# Altium schematic sheet FlightController.SchDoc
size A2; SheetNumber: 1; SheetTotal: 1
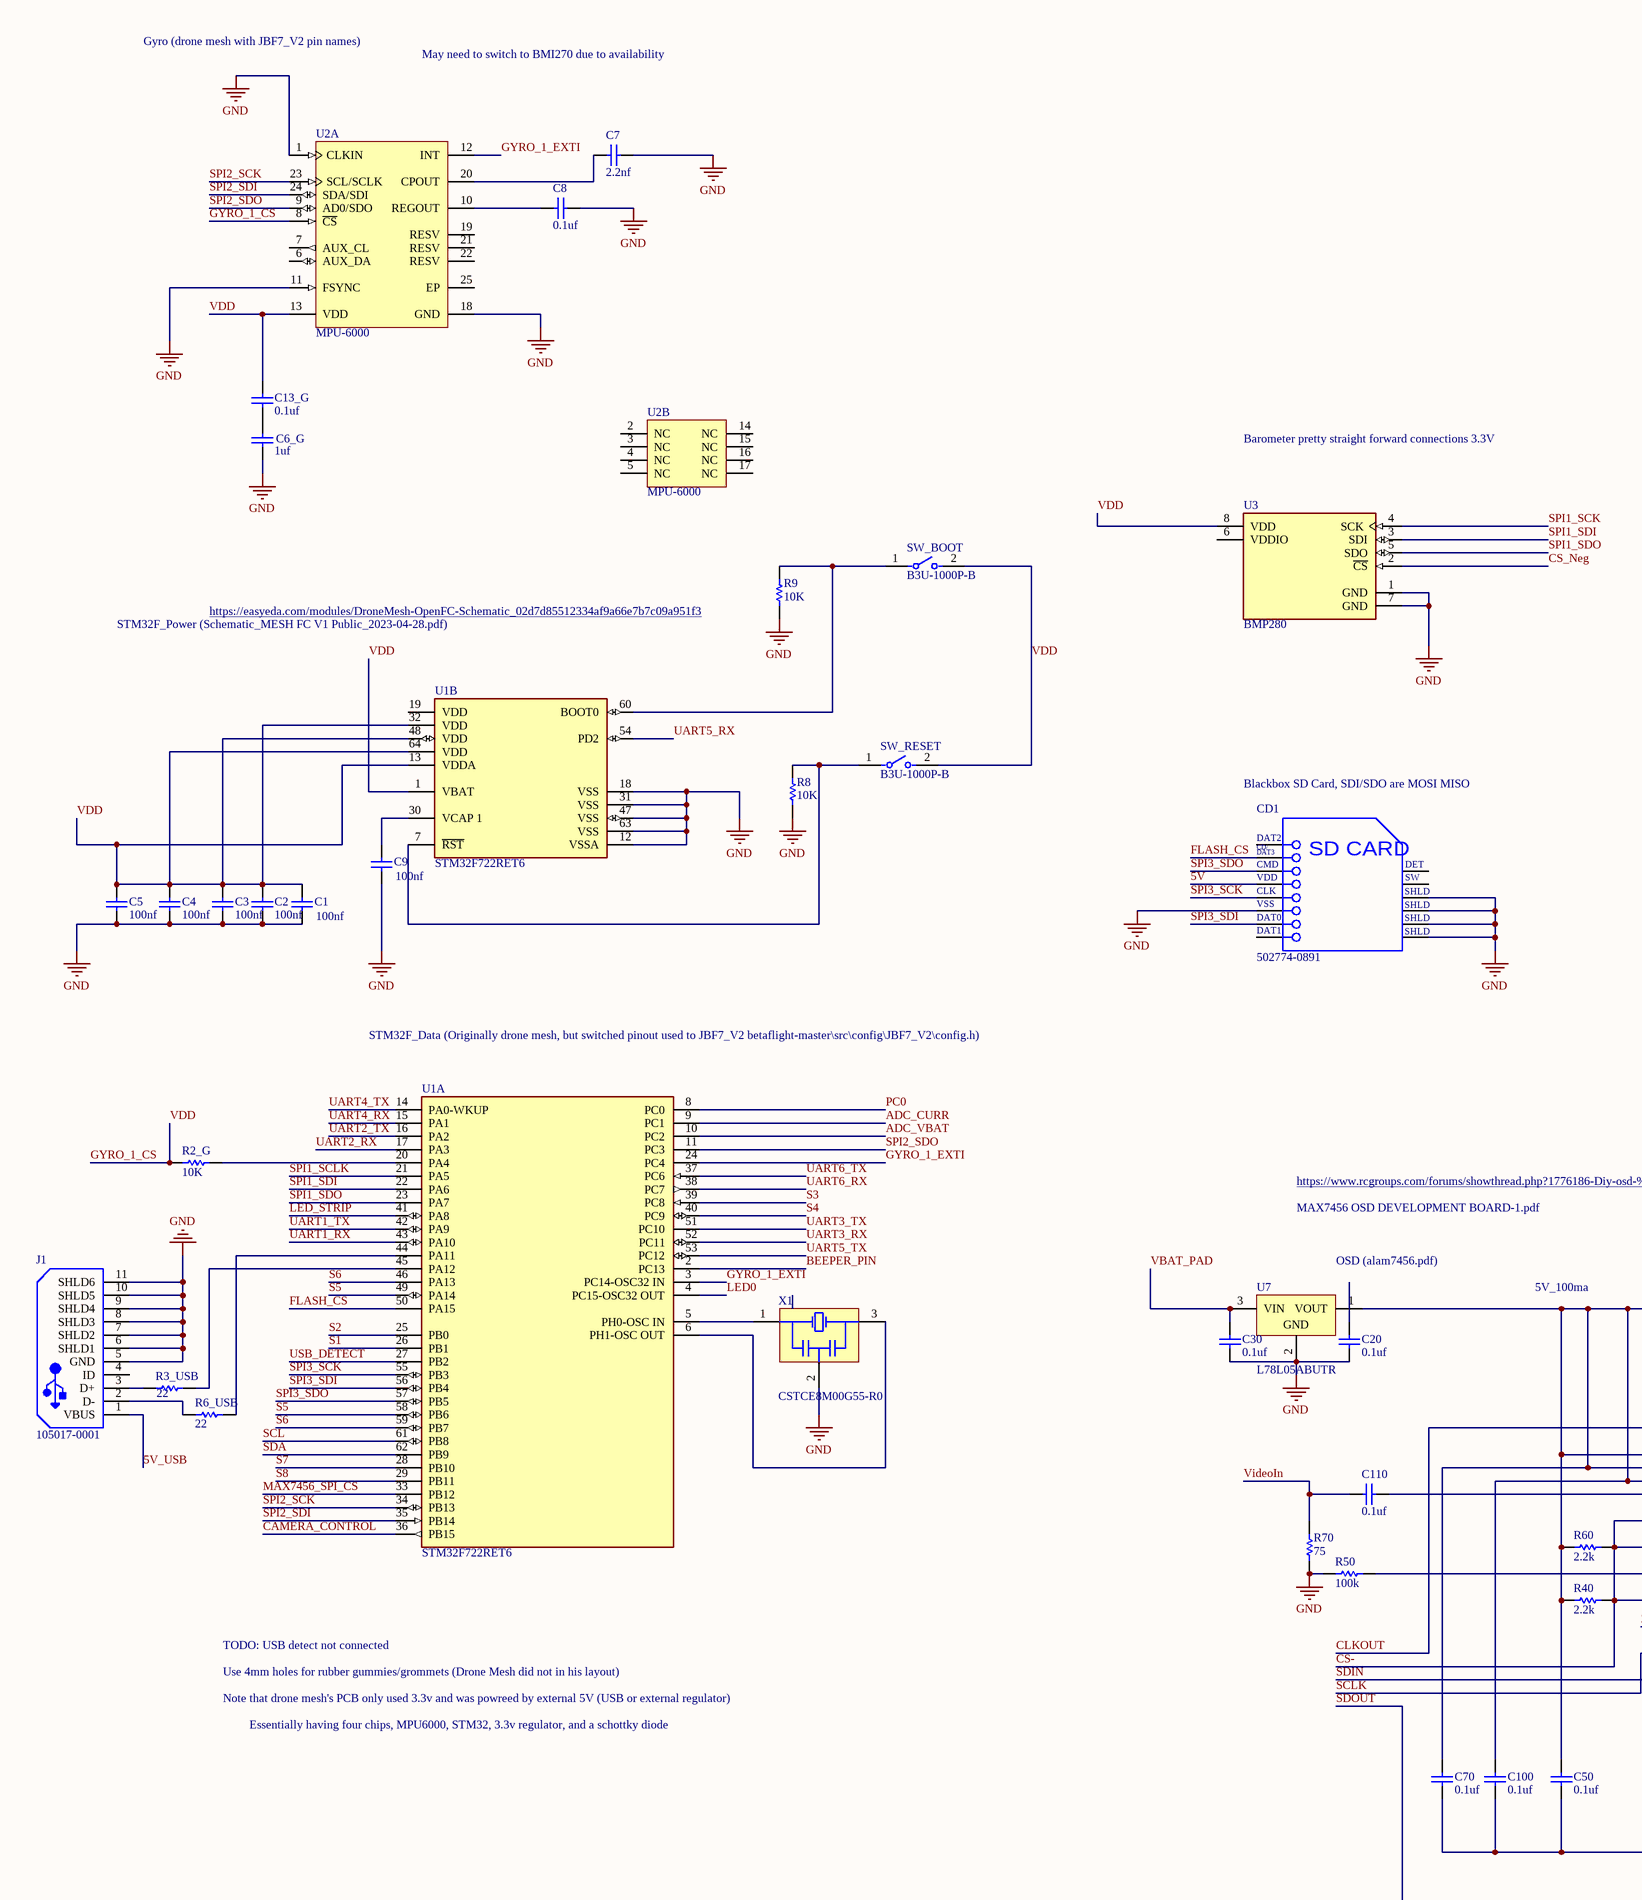
[diagram p0: FlightController.SchDoc, left]
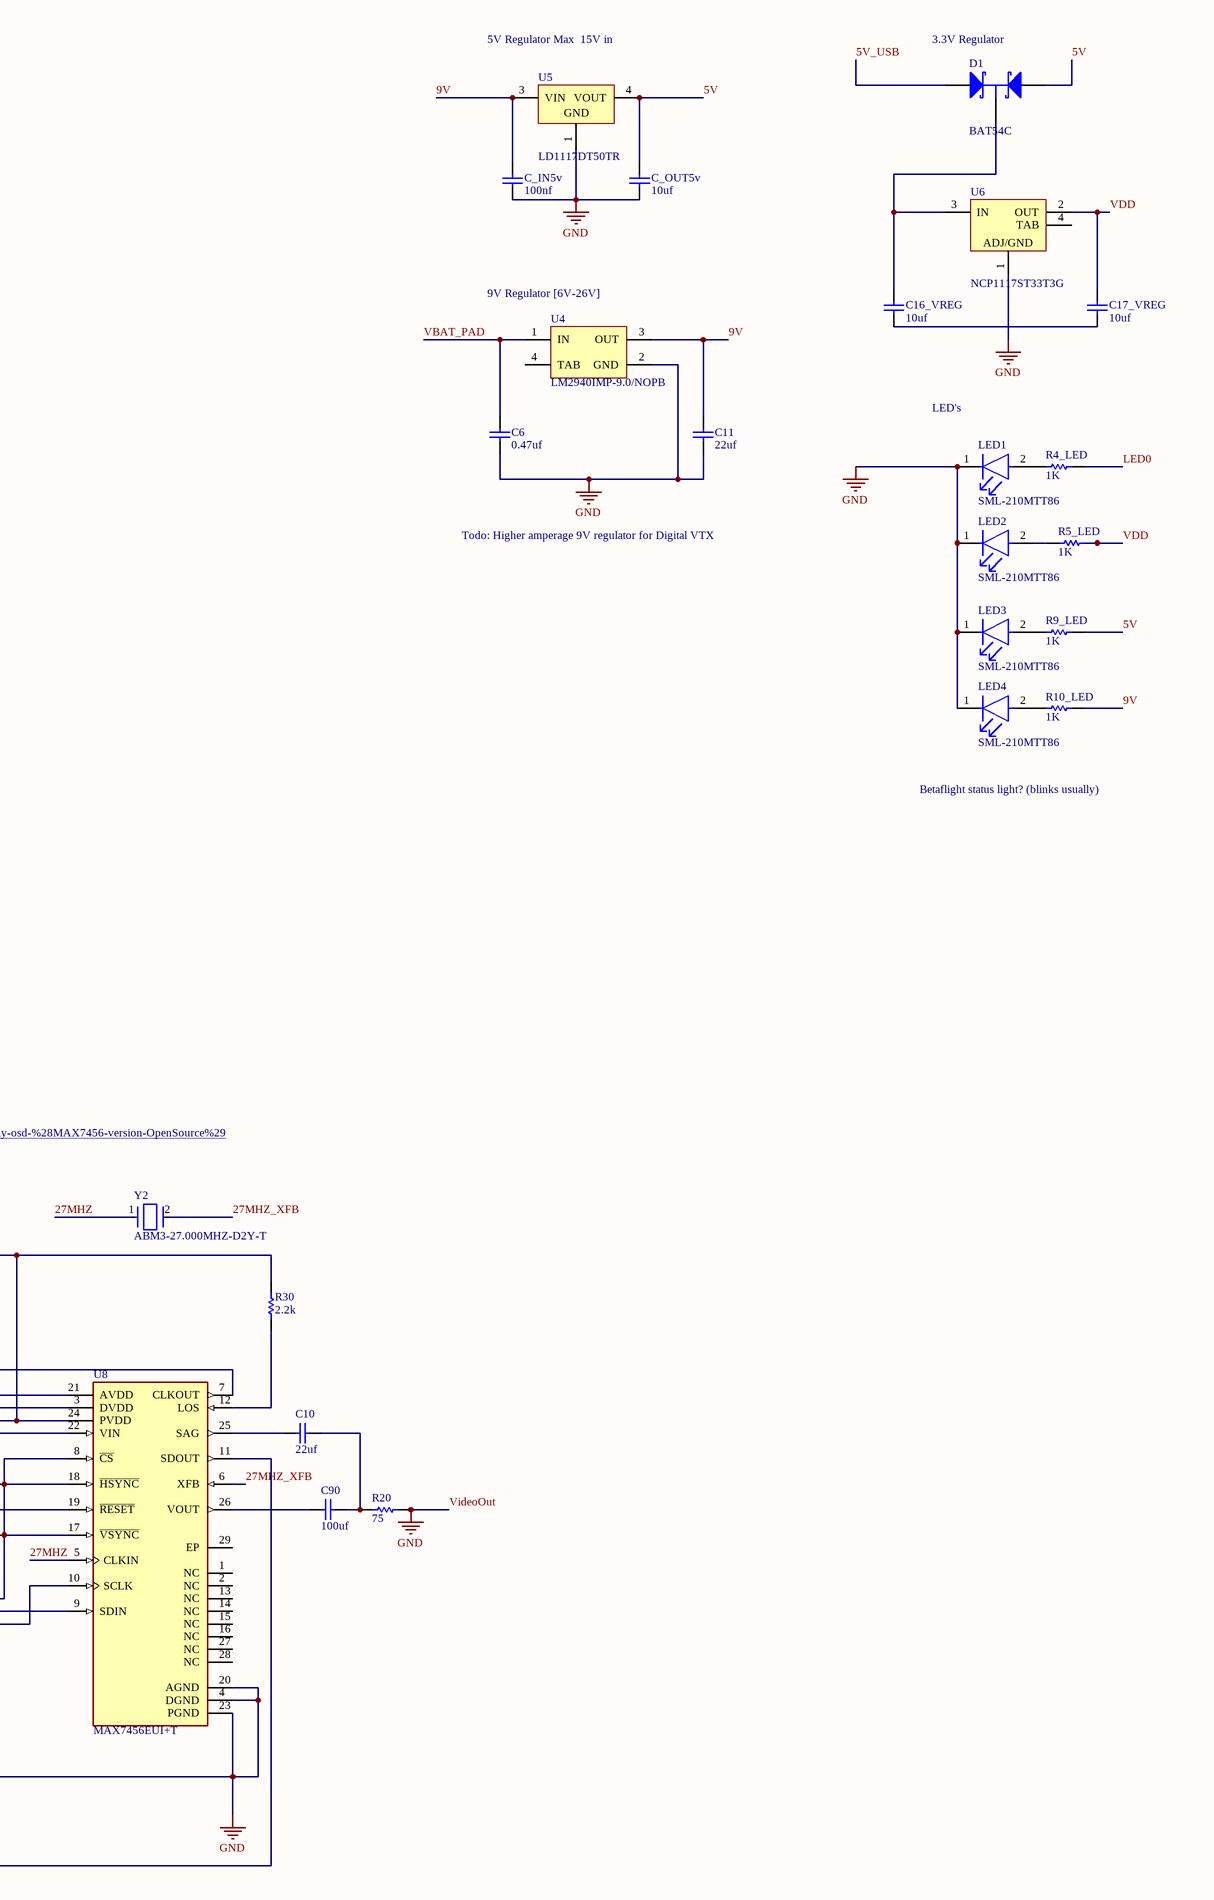
[diagram p1: FlightController.SchDoc, right]

## Parts
C1  value 100nf  [0805]  (hidden comment: Capacitor)
C2  value 100nf  [0805]  (hidden comment: Capacitor)
C3  value 100nf  [0805]  (hidden comment: Capacitor)
C4  value 100nf  [0805]  (hidden comment: Capacitor)
C5  value 100nf  [0805]  (hidden comment: Capacitor)
C6  value 0.47uf  [0805]  (hidden comment: Capacitor)
C6_G  value 1uf  [0805]  (hidden comment: Capacitor)
C7  value 2.2nf  [0805]  (hidden comment: Capacitor)
C8  value 0.1uf  [0805]  (hidden comment: Capacitor)
C9  value 100nf  [0805]  (hidden comment: Capacitor)
C10  value 22uf  [0805]  (hidden comment: Capacitor)
C11  value 22uf  [0805]  (hidden comment: Capacitor)
C13_G  value 0.1uf  [0805]  (hidden comment: Capacitor)
C16_VREG  value 10uf  [0805]  (hidden comment: Capacitor)
C17_VREG  value 10uf  [0805]  (hidden comment: Capacitor)
C20  value 0.1uf  [0805]  (hidden comment: Capacitor)
C30  value 0.1uf  [0805]  (hidden comment: Capacitor)
C50  value 0.1uf  [0805]  (hidden comment: Capacitor)
C70  value 0.1uf  [0805]  (hidden comment: Capacitor)
C90  value 100uf  [0805]  (hidden comment: Capacitor)
C100  value 0.1uf  [0805]  (hidden comment: Capacitor)
C110  value 0.1uf  [0805]  (hidden comment: Capacitor)
C_IN5v  value 100nf  [0805]  (hidden comment: Capacitor)
C_OUT5v  value 10uf  [0805]  (hidden comment: Capacitor)
CD1  502774-0891  [MOLX-502774-0891_V]
D1  BAT54C  [NXP-SOT23-3_V]
J1  105017-0001  [USB-MICRO-B_V]
LED1  SML-210MTT86  [FP-SML-210-MFG]
LED2  SML-210MTT86  [FP-SML-210-MFG]
LED3  SML-210MTT86  [FP-SML-210-MFG]
LED4  SML-210MTT86  [FP-SML-210-MFG]
R2_G  value 10K  [0402]  (hidden comment: Resistor)
R3_USB  value 22  [0402]  (hidden comment: Resistor)
R4_LED  value 1K  [0402]  (hidden comment: Resistor)
R5_LED  value 1K  [0402]  (hidden comment: Resistor)
R6_USB  value 22  [0402]  (hidden comment: Resistor)
R8  value 10K  [0402]  (hidden comment: Resistor)
R9  value 10K  [0402]  (hidden comment: Resistor)
R9_LED  value 1K  [0402]  (hidden comment: Resistor)
R10_LED  value 1K  [0402]  (hidden comment: Resistor)
R20  value 75  [0402]  (hidden comment: Resistor)
R30  value 2.2k  [0402]  (hidden comment: Resistor)
R40  value 2.2k  [0402]  (hidden comment: Resistor)
R50  value 100k  [0402]  (hidden comment: Resistor)
R60  value 2.2k  [0402]  (hidden comment: Resistor)
R70  value 75  [0402]  (hidden comment: Resistor)
SW_BOOT  B3U-1000P-B  [FP-B3U-1000P-B-MFG]
SW_RESET  B3U-1000P-B  [FP-B3U-1000P-B-MFG]
U1  STM32F722RET6  [FP-LQFP64-5W-IPC_A]  (parts A,B of 2)
U2  MPU-6000  [INSE-QFN-24_V]  (parts A,B of 2)
U3  BMP280  [FP-BMP280-MFG]
U4  LM2940IMP-9.0/NOPB  [DCY0004A_L]
U5  LD1117DT50TR  [TO-252_N]
U6  NCP1117ST33T3G  [ONSC-SOT-223-4-318H-01_A_V]
U7  L78L05ABUTR  [SOT-89_N]
U8  MAX7456EUI+T  [FP-U28E-5-MFG]
X1  CSTCE8M00G55-R0  [MURA-CSTCE_G_A-3_V]
Y2  ABM3-27.000MHZ-D2Y-T  [FP-ABM3-MFG]

## Nets
VideoOut: C1.1 C2.1 C3.1 C4.1 C5.1 C6.1 C6_G.1 C7.2 C8.2 C9.1 C11.1 C20.2 C30.2 C50.1 C70.1 C100.1 C_IN5v.1 C_OUT5v.1 CD1.6(VSS) CD1.11(SHLD) CD1.12(SHLD) CD1.13(SHLD) CD1.14(SHLD) J1.5(GND) J1.6(SHLD1) J1.7(SHLD2) J1.8(SHLD3) J1.9(SHLD4) J1.10(SHLD5) J1.11(SHLD6) LED1.1(C) LED2.1(C) LED3.1(C) LED4.1(C) R8.1 R9.1 R20.2 R50.2 R70.1 U1.12(VSSA) U1.18(VSS) U1.31(VSS) U1.47(VSS) U1.63(VSS) U2.1(CLKIN) U2.11(FSYNC) U2.18(GND) U3.1(GND) U3.7(GND) U4.2(GND) U5.1(GND) U6.1(ADJ/GND) U7.2(GND) U8.4(DGND) U8.20(AGND) U8.23(PGND) X1.2(GND)  [also labelled GND]
5V: C_OUT5v.2 CD1.4(VDD) D1.1(A) R9_LED.2 U5.4(VOUT)
5V_USB: D1.2(A) J1.1(VBUS)
9V: C11.2 C_IN5v.2 R10_LED.2 U4.3(OUT) U5.3(VIN)
27MHZ: U8.5(CLKIN) Y2.1
27MHZ_XFB: U8.6(XFB) Y2.2
ADC_CURR: U1.9(PC1)
ADC_VBAT: U1.10(PC2)
BEEPER_PIN: U1.2(PC13)
CAMERA_CONTROL: U1.36(PB15)
CLKOUT: U8.7(CLKOUT)
CS-: R40.1 R60.1 U8.8(~{CS}) U8.17(~{VSYNC}) U8.18(~{HSYNC})
CS_Neg: U3.2(~{CS})
FLASH_CS: CD1.2(CD/DAT3) U1.50(PA15)
GYRO_1_CS: C1.2 C2.2 C3.2 C4.2 C5.2 C13_G.2 C17_VREG.2 R2_G.1 R5_LED.2 SW_BOOT.2 SW_RESET.2 U1.1(VBAT) U1.13(VDDA) U1.32(VDD) U1.48(VDD) U1.64(VDD) U2.8(~{CS}) U2.13(VDD) U3.8(VDD) U6.2(OUT)  [also labelled VDD]
GYRO_1_EXTI: U1.3(PC14-OSC32_IN) U1.24(PC4) U2.12(INT)
LED0: R4_LED.2 U1.4(PC15-OSC32_OUT)
LED_STRIP: U1.41(PA8)
MAX7456_SPI_CS: U1.33(PB12)
PC0: U1.8(PC0)
S1: U1.26(PB1)
S2: U1.25(PB0)
S3: U1.39(PC8)
S4: U1.40(PC9)
S5: U1.49(PA14) U1.58(PB6)
S6: U1.46(PA13) U1.59(PB7)
S7: U1.28(PB10)
S8: U1.29(PB11)
SCL: U1.61(PB8)
SCLK: U8.10(SCLK)
SDA: U1.62(PB9)
SDIN: U8.9(SDIN)
SDOUT: U8.11(SDOUT)
SPI1_SCK: U3.4(SCK)
SPI1_SCLK: U1.21(PA5)
SPI1_SDI: U1.22(PA6) U3.3(SDI)
SPI1_SDO: U1.23(PA7) U3.5(SDO)
SPI2_SCK: U1.34(PB13) U2.23(SCL/SCLK)
SPI2_SDI: U1.35(PB14) U2.24(SDA/SDI)
SPI2_SDO: U1.11(PC3) U2.9(AD0/SDO)
SPI3_SCK: CD1.5(CLK) U1.55(PB3)
SPI3_SDI: CD1.7(DAT0) U1.56(PB4)
SPI3_SDO: CD1.3(CMD) U1.57(PB5)
UART1_RX: U1.43(PA10)
UART1_TX: U1.42(PA9)
UART2_RX: U1.17(PA3)
UART2_TX: U1.16(PA2)
UART3_RX: U1.52(PC11)
UART3_TX: U1.51(PC10)
UART4_RX: U1.15(PA1)
UART4_TX: U1.14(PA0-WKUP)
UART5_RX: U1.54(PD2)
UART5_TX: U1.53(PC12)
UART6_RX: U1.38(PC7)
UART6_TX: U1.37(PC6)
USB_DETECT: U1.27(PB2)
VBAT_PAD: C6.2 C30.1 U4.1(IN) U7.3(VIN)
VideoIn: C110.2 R70.2
NetC6_G_2: C6_G.2 C13_G.1
NetC7_1: C7.1 U2.20(CPOUT)
NetC8_1: C8.1 U2.10(REGOUT)
NetC9_2: C9.2 U1.30(VCAP_1)
NetC10_1: C10.1 U8.25(SAG)
NetC10_2: C10.2 C90.2 R20.1
NetC16_VREG_1: C16_VREG.1 C17_VREG.1
NetC16_VREG_2: C16_VREG.2 D1.3(K) U6.3(IN)
NetC50_2: C50.2 C70.2 C100.2 R30.2 R40.2 R60.2 U7.1(VOUT) U8.3(DVDD) U8.21(AVDD) U8.24(PVDD)
NetC90_1: C90.1 U8.26(VOUT)
NetC110_1: C110.1 U8.22(VIN)
NetJ1_2: J1.2(D-) R6_USB.1
NetJ1_3: J1.3(D+) R3_USB.1
NetLED1_2: LED1.2(A) R4_LED.1
NetLED2_2: LED2.2(A) R5_LED.1
NetLED3_2: LED3.2(A) R9_LED.1
NetLED4_2: LED4.2(A) R10_LED.1
NetR2_G_2: R2_G.2 U1.20(PA4)
NetR3_USB_2: R3_USB.2 U1.45(PA12)
NetR6_USB_2: R6_USB.2 U1.44(PA11)
NetR8_2: R8.2 SW_RESET.1 U1.7(~{RST})
NetR9_2: R9.2 SW_BOOT.1 U1.60(BOOT0)
NetR30_1: R30.1 U8.12(LOS)
NetR50_1: R50.1 U8.19(~{RESET})
NetU1_5: U1.5(PH0-OSC_IN) X1.1(X1)
NetU1_6: U1.6(PH1-OSC_OUT) X1.3(X2)

Not connected (* = marked no-connect by the designer): C20 1; CD1 1(DAT2) 8(DAT1) 9(DETECT) 10(SWITCH); J1 4(ID); U1 19(VDD); U2 2(NC) 3(NC) 4(NC) 5(NC) 6(AUX_DA) 7(AUX_CL) 14(NC) 15(NC) 16(NC) 17(NC) 19(RESV) 21(RESV) 22(RESV) 25(EP); U3 6(VDDIO); U4 4(TAB); U6 4(TAB); U8 1(NC) 2(NC) 13(NC) 14(NC) 15(NC) 16(NC) 27(NC) 28(NC) 29(EP)

## Notes on the sheet
- Gyro (drone mesh with JBF7_V2 pin names)
- May need to switch to BMI270 due to availability
- 5V Regulator Max  15V in
- (near D1) 3.3V Regulator
- (near U4) 9V Regulator [6V-26V]
- Barometer pretty straight forward connections 3.3V
- LED's
- Todo: Higher amperage 9V regulator for Digital VTX
- STM32F_Power (Schematic_MESH FC V1 Public_2023-04-28.pdf)
- (near R9) https://easyeda.com/modules/DroneMesh-OpenFC-Schematic_02d7d85512334af9a66e7b7c09a951f3
- Blackbox SD Card, SDI/SDO are MOSI MISO
- Betaflight status light? (blinks usually)
- STM32F_Data (Originally drone mesh, but switched pinout used to JBF7_V2 betaflight-master\src\config\JBF7_V2\config.h)
- https://www.rcgroups.com/forums/showthread.php?1776186-Diy-osd-%28MAX7456-version-OpenSource%29
- MAX7456 OSD DEVELOPMENT BOARD-1.pdf
- (near U7) OSD (alam7456.pdf)
- 5V_100ma
- TODO: USB detect not connected
- Use 4mm holes for rubber gummies/grommets (Drone Mesh did not in his layout)
- Note that drone mesh's PCB only used 3.3v and was powreed by external 5V (USB or external regulator)
- Essentially having four chips, MPU6000, STM32, 3.3v regulator, and a schottky diode
- (in symbol CMP-2000-05248-1) CD/; DAT3; SD CARD; DET; SW

## Library data of the parts
C1-C6 C6_G C7-C11 C13_G C16_VREG C17_VREG C20 C30 C50 C70 C90 C100 C110 C_IN5v C_OUT5v = Capacitor: SimulationGenericComponent: True
CD1 = CMP-2000-05248-1: Micro SD Memory Card Connector, 0.5 A, 10 V (DC), -25 to 85 degC, 8-Pin SMT, RoHS, Tape and Reel; Manufacturer: Molex; 3D Model: 502774-0891.stp; Online Catalog: microSD™Series; Number of Positions: 10(8+2); Card Type: SecureDigital-microSD™; Insertion, Removal Method: PushIn,PushOut; Other Names: WM24066DKR; Connector Type: ConnectorandEjector; Features: Switch; Family: MemoryConnectors-PCCardSockets; Manufacturer URL: http://www.molex.com/; Mounting Type: SurfaceMount,RightAngle; Contact Finish Thickness: 20µin(0.51µm); Standard Package: 1; Series: 502774; Ejector Side: -; Datasheet Version: Rev. D, 04/2004; Category: Connectors,Interconnects; Contact Finish: Gold; Datasheet URL: https://datasheet.ciiva.com/1104/1499551-1104671.pdf; RoHS Information: 502774-0891CertofCompliance; Mounting Feature: Reverse-Bottom; Packaging: Digi-Reel; Height Above Board: 0.071"(1.80mm); Catalog Drawings: 502774-0891
D1 = CMP-0417-00003-1: Schottky Barrier Diode, 30 V, 2 uA, -55 to 150 degC, 3-Pin SOT23, RoHS, Tape and Reel; Manufacturer: NXP Semiconductors; IR (uA): 2; VF (mV): 800; Trr (ns): 5; Cd (pF): 10; VR (V): 30; Rth(j-a) (K/W): 500; RoHS: TRUE; Packing: Tape and Reel; ComponentLink2URL: http://www.nxp.com/documents/data_sheet/BAT54_SER.pdf; PartNumber: BAT54C; ComponentLink2Description: Datasheet; Temperature Range: -55 to 150 degC; PackageReference: SOT23-3; PackageDescription: 3-Pin Plastic Surface-mounted Package, Body 1.3 x 2.9 mm, Pitch 0.95 mm; Mounting Technology: Surface Mount; ComponentLink1URL: http://www.nxp.com/; DatasheetVersion: Rev. 5; ComponentLink1Description: Manufacturer URL
J1 = CMP-2000-05827-1: Micro-USB B Receptacle, Right Angle, Bottom Mount, Surface Mount, with Solder Tabs, -30 to 85 degC, 5-Pin USB, RoHS, Tape and Reel; Manufacturer: Molex; Featured Product: Micro-USBConnectorsUSBConnectors; Other Names: WM1399DKR; Package Version: Rev. F, 12/2012; Number of Contacts: 5; Connector Type: USB-microB; Catalog Drawings: 1050170001; 3D Model: 105017-0001.stp; Mating Products: WM17145-ND-CABLEMICROUSBBTOSTDA1.0MWM17147-ND-CABLEMICROUSBBTOSTDA2.0MWM17146-ND-CABLEMICROUSBBTOSTDA1.5M; PCN Assembly/Origin: ResinSupplier21/Oct/2015; Voltage - Max: 30V; Online Catalog: Molex-MicroUSB; Manufacturer URL: http://www.molex.com/; Package Description: 5-Leads USB, Micro B, Body 7.5 x 5 mm, Pitch 0.65 mm; Datasheet URL: http://www.molex.com/elqNow/elqRedir.htm?ref=http://www.molex.com/webdocs/datasheets/pdf/en-us/1050170001_IO_CONNECTORS.pdf; Ingress Protection: -; Datasheet Version: 03/2016; Mounting Type: BoardCutout,SurfaceMount,RightAngle; Circuits: 5; Standard Package: 1; Package Reference: MICRO-B; Package URL: http://www.molex.com/pdm_docs/sd/1050170001_sd.pdf; Category: Connectors,Interconnects; Series: -; RoHS Information: 1050170001CertofCompliance; Features: Shielded,SolderRetention; Family: USB,DVI,HDMIConnectors; Specifications: -; Gender: Receptacle; Packaging: Digi-Reel®; Mounting Technology: SurfaceMount
LED1-LED4 = CMP-08952-000013-1: LED GREEN CLEAR 0805 SMD; Manufacturer: ROHM; Forward Current: 20mA; Reverse Voltage: 4V; Peak Emmision Wavelength: 573nm; Forward Voltage: 2.2V; Luminous Intensity: 16mcd; Power Dissipation: 70mW; Led Orientation: Top View; Wavelength: 570nm; Device Class L2: LEDs; Colour: Green; Height: 0.90mm; Ipc Land Pattern Name: DIOCP200125X25; Manufacturer Part Number: SML-210MTT86; Automotive: No; Temperature Range High: +85°C; Device Class L3: unset; Temperature: -30°C to +85°C; Device Class L1: Optoelectronics; Mouser Description: Standard LEDs - SMD GREEN SMD TRANS LENS; Temperature Range Low: -30°C; Package: SML-210; Digikey Description: LED GREEN CLEAR 0805 SMD; Lead Free: Yes; ComponentLink2URL: https://www.mouser.in/ds/2/348/sml-21-313092.pdf; ComponentLink2Description: Datasheet; Octopart: https://octopart.com/sml-210mtt86-rohm-550711; RoHS: TRUE; Category: Diode
R2_G R3_USB R4_LED R5_LED R6_USB R8 R9 R9_LED R10_LED R20 R30 R40 R50 R60 R70 = Resistor: TC1: 0; SimulationGenericComponent: True; TC2: 0
SW_BOOT SW_RESET = CMP-08834-000005-1: SWITCH TACTILE SPST-NO 0.05A 12V; Manufacturer: Omron; Description: Tactile Switch SPST-NO Top Actuated Surface Mount; Operating Force: 1.5N; Contact Current Rating: 50mA; Contact Resistance: 100mΩ; Electromechanical Life: 200000Cycles; Height: 1.75mm; Device Class L2: Switches; Temperature Range High: +70°C; Digikey Description: SWITCH TACTILE SPST-NO 0.05A 12V; Throw Configuration: SPST-NO; Ambient Temperature Range High: +70°C; Temperature: -25°C to +70°C; Lead Free: Yes; ComponentLink2URL: https://omronfs.omron.com/en_US/ecb/products/pdf/en-b3u.pdf; Device Class L3: Tactile Switches; Manufacturer Part Number: B3U-1000P-B; Ambient Temperature Range Low: -25°C; Mount: Surface Mount; Automotive: No; Mouser Description: Tactile Switches Top Actuated with boss w/o ground; Octopart: https://octopart.com/b3u-1000p-b-omron-1057356; RoHS: TRUE; Package: 0; Device Class L1: Electromechanical; Voltage Rating Dc: 12V; Category: Switch; Temperature Range Low: -25°C; ComponentLink2Description: Datasheet
U1 = CMP-12105-000139-1: IC MCU 32BIT 512KB FLASH 64LQFP; Interface: I2C; Number of I/Os: 50; Peripherals: Brown-out Detect/Reset; Core Architecture: ARM; Oscillator Type: Internal; Frequency: 216MHz; Memory Size: 512KB; Min Operating Temperature: -40°C; Max Operating Temperature: 85°C; Mount: Surface Mount; Case/Package: LQFP; Memory Type: FLASH; Packaging: Tray
U2 = CMP-2000-05008-1: 3-Axis Gyroscope 3-Axis Accelerometer Motion Processing Unit with I2C and SPI, 2.5, 3 or 3.3 V, -40 to 85 degC, 24-Pin QFN, RoHS, Tape and Reel; Manufacturer: InvenSense; Featured Product: MPU60006AxisIntegratedSPISolution; Output Type: I²C,SPI; Sensor Type: Accelerometer,Gyroscope,3Axis; Other Names: 1428-1005-2 / MPU6000; Online Catalog: MPU-6000™Series; Operating Temperature: -40degC~85degC(TA); Datasheet URL: https://www.invensense.com/wp-content/uploads/2015/02/MPU-6000-Datasheet1.pdf; Manufacturer URL: http://www.invensense.com/; Datasheet Version: Rev. 3.4, 08/2013; Standard Package: 5,000; Family: Multifunction; Package Reference: QFN-24; Category: Sensors,Transducers; Package Description: 24-Pin Quad Flat No-lead Package, Body 4 x 4 mm, Pitch 0.5 mm
U3 = CMP-2000-05076-3: SENSOR PRESSURE ABS; Operating Pressure: 15.95PSI; Pressure Type: Absolute; Output Type: SPI; Max Pressure: 290.08PSI; Port Style: No Port; Case/Package: SMD/SMT; Lead Free: Lead Free; Termination: SMD/SMT; Min Operating Temperature: -40°C; Number of Pins: 8; Max Operating Temperature: 85°C
U4 = CMP-0062-01727-3: 1A Low Dropout Regulator, 4-pin SOT-223, Pb-Free; Manufacturer: Texas Instruments; PackageTopMarking: XYTT*L0EB; PowerWise: N; CompType: LDO IC; PinCount: 4; ComponentLink1Description: Datasheet URL; ComponentLink1URL: http://www.ti.com/general/docs/lit/getliterature.tsp?genericPartNumber=LM2940-N&fileType=pdf; PackageReference: DCY0004A; Code_IPC: SOT223-4; RoHS: Y; Code_JEDEC: TO-261-AA; PackageDescription: Molded SOT-223, 6.50 x 3.56 x 1.6mm Body, 4 Lead, 2.3mm Pitch
U5 = CMP-0244-00108-1: Fixed Low Drop Positive Voltage Regulator, 5V, 3-Pin DPAK, Tape and Reel; ComponentLink1URL: http://www.st.com; ComponentLink1Description: Manufacturer URL; ComponentLink2Description: Datasheet; PackageDescription: 3-Pin Transistor Outline Package 2.28 mm Pitch, 9.7 mm Lead Span (DPAK); PackageVersion: 2011; ComponentLink2URL: http://www.st.com/internet/com/TECHNICAL_RESOURCES/TECHNICAL_LITERATURE/DATASHEET/CD00000544.pdf; PackageReference: TO-252; DatasheetVersion: 1/11/2011
U6 = CMP-1679-00010-1: Low-Dropout Positive Fixed Voltage Regulator, 1 A, 3.3 V Output Voltage, 0 to 125 degC, 4-Pin SOT-223 (318H-01), Pb-Free, Tape and Reel; Resistance: 220 kohm; Type (Resistor): Thick Film; Voltage Rating: 75 V; Tolerance: 1%; Case\Package: 0603; Power Rating: 100 mW; Width: 0.85 mm; Weight: 7.1E-05 oz; ComponentLink2URL: http://www.onsemi.com/pub_link/Collateral/NCP1117-D.PDF; RoHSCompliant: true; Height: 0.45 mm; PackageDescription: 4-Pin Small Outline Transistor, Body 6.5 x 3.5 mm, Pitch 2.3 mm; ComponentLink1Description: Manufacturer URL; ComponentLink1URL: http://www.onsemi.com/; PackageReference: SOT-223-4-318H-01_A; Max Operating Temperature: 155 degC; Packaging: Tape and Reel; REACH SVHC: Unknown; Length: 1.55 mm; Package Quantity: 5000; Radiation Hardening: No; Min Operating Temperature: -55 degC; DatasheetVersion: Rev. 27, 09/2014; Mount: Surface Mount; Case Code (Imperial): 0603; Case Code (Metric): 1608; ComponentLink2Description: Datasheet
U7 = CMP-0244-00406-1: Positive Voltage Regulator, 5V, 4-Pin SOT-89, Tape and Reel; PackageVersion: 2011; DatasheetVersion: 1/02/2011; PackageDescription: 3-Pin SOT-89 Package 1.5 mm Pitch, 4.1 mm Lead Span; PackageReference: SOT-89; ComponentLink2Description: Datasheet; ComponentLink1URL: http://www.st.com; ComponentLink1Description: Manufacturer URL; ComponentLink2URL: http://www.st.com/internet/com/TECHNICAL_RESOURCES/TECHNICAL_LITERATURE/DATASHEET/CD00000446.pdf
U8 = CMP-05676-000004-1: IC DISPLAY 1CH W/EEPROM 28TSSOP; Obsolete Part: true; Manufacturer: Maxim Integrated; Nominal Supply Current: 24-58mA; Min Supply Voltage: 4.75V; Max Supply Voltage: 5.25V; Max Junction Temp: +150°C; Standoff Height: 0.05mm; Interface: SPI; Temperature Range High: +85°C; Package: U28E-5; Octopart: https://octopart.com/max7456eui%2Bt-maxim+integrated-42626431; Device Class L3: unset; ComponentLink2Description: Datasheet; Digikey Description: IC DISPLAY 1CH W/EEPROM 28TSSOP; Temperature: -40°C to +85°C; Automotive: No; Ipc Land Pattern Name: SOP65P638X110-28; Device Class L2: Interface ICs; Lead Free: Yes; RoHS: TRUE; Manufacturer Part Number: MAX7456EUI+T; ComponentLink2URL: https://datasheets.maximintegrated.com/en/ds/MAX7456.pdf; Footprint Url: https://pdfserv.maximintegrated.com/package_dwgs/21-0108.PDF; Height: 1.1mm; Temperature Range Low: -40°C; Device Class L1: Integrated Circuits (ICs); Category: IC
X1 = CMP-2100-03620-1: Ceramic Resonator, 8 MHz, +/- 0.5%, -20 to 80 degC, 3-Pin SMD, RoHS, Tape and Reel; Manufacturer: Murata; Capacitance: 33pF; Frequency Stability: 0.2%; Self Resonant Frequency: 8MHz; Datasheet Version: 42339.0; RoHSCompliant: True; Datasheet URL: http://www.murata.com/~/media/webrenewal/support/library/catalog/products/timingdevice/ceralock/p16e.ashx; Case/Package: Ceramic; Load Capacitance: 33pF; Tolerance: 0.5%; Mount: SurfaceMount; Height: 0.031inch; Number of Pins: 3; Package Description: 3-Pin Surface Mount Device, Body 3.2 x 1.3 mm, Pitch 1.2 mm; Package Quantity: 1; Lead Free: LeadFree; Contact Plating: Gold; REACH SVHC: NoSVHC; Length: 0.126inch; Width: 0.051inch; Manufacturer URL: http://www.murata.com/; Packaging: TapeandReel; Termination: SMD/SMT; Frequency Tolerance: 0.5%; Max Operating Temperature: 80degC; Composition: Ceramic; Package Reference: CSTCE_G_A-3; Min Operating Temperature: -20degC; Frequency: 8MHz
Y2 = CMP-27762-013610-1: Crystal 27MHz ±20ppm 18pF SMD-2 5mm x 3.2mm; Series Resistance: 30R; Frequency Stability: 30ppm; Package Quantity: 1000; Mount: Surface Mount; Height: 0.051inch; Lead Free: Lead Free; Frequency: 27MHz; Load Capacitance: 18pF; REACH SVHC: No SVHC; Termination: SMD/SMT; Tolerance: 20ppm; Depth: 3.2mm; Case/Package: SMD/SMT; Number of Pins: 2; Frequency Tolerance: 20ppm; Series: ABM3; Max Operating Temperature: 85°C; Packaging: Tape and Reel; ESR (Equivalent Series Resistance): 30R; Min Operating Temperature: -40°C; Resistor Type: Ceramic; RoHS Compliant: Yes; Length: 5mm; Width: 0.126inch